# Altium schematic sheet MP2359_ADJ_StepDown100mA.SchDoc: MP2359 ADJ Step Down 100mA
size 152 x 101 mm; Date: 26.07.2015; ApprovedBy: Pavel Nadein; CheckedBy: Pavel Nadein; Author: Pavel Nadein; DrawnBy: Pavel Nadein; Engineer: Pavel Nadein; Revision: P1A; DocumentName: MP2359 ADJ Step Down 100mA
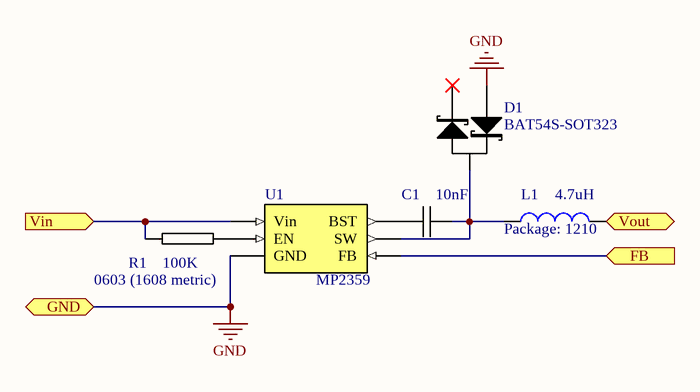
[diagram p0: MP2359_ADJ_StepDown100mA.SchDoc]

## Parts
C1  10nF  [0603C-GENERIC]
D1  BAT54S-SOT323  [SOT323-123]
L1  Inductance: 4.7uH  Package: 1210  [C_1210]  (hidden comment: IND)
R1  100K  Case: 0603 (1608 metric)  [0603R-100K]
U1  MP2359  [TSOP23-6]

## Ports
FB (in), GND, Vin (in), Vout (out)

## Nets
GND: D1.1 U1.2(GND) ; port GND
FB: U1.3(FB) ; port FB
Vin: R1.1 U1.5(Vin) ; port Vin
Vout: L1.2 ; port Vout
NetC1_1: C1.1 U1.1(BST)
NetC1_2: C1.2 D1.3 L1.1 U1.6(SW)
NetR1_2: R1.2 U1.4(EN)

Not connected (* = marked no-connect by the designer): D1 2*

## Library data of the parts
C1 = 0603C-10NF-50V-X7R-MUR: CAPACITOR 0603 CERAMIC; Manufacturer Part Number: GRM188R71H103KA01D; Manufacturer: Murata Electronics North America; Reel: C22; Supplier 1: Digi-Key; Supplier Part Number 1: 490-1512-2-ND
D1 = BAT54S-SOT323: DUAL SCHOTTKY DIODE SERIES; Manufacturer: NXP Semiconductors; Manufacturer Part Number: BAT54SW,115; Voltage - Forward (Vf) (Max) @ If: 800mV @ 100mA; Current - Reverse Leakage @ Vr: 2µA @ 25V; Speed: Small Signal =< 200mA (Io), Any Speed; Diode Configuration: 1 Pair Series Connection; Current - Average Rectified (Io) (per Diode): 200mA (DC); Voltage - DC Reverse (Vr) (Max): 30V; Reverse Recovery Time (trr): 5ns; Supplier 1: Digi-Key; Supplier Part Number 1: 568-1615-2-ND; Mounting Type: Surface Mount; Packaging: Tape & Reel (TR); Package / Case: SC-70-3, SOT-323-3; Diode Type: Schottky; Supplier Part Number: 568-1615-2-ND; Category: Discrete Semiconductor Products; Supplier: Digi-Key; RoHS: RoHS Compliant
L1 = Inductor
R1 = 0603R-100K: GENERIC RESISTOR 0603; Manufacturer Part Number: RMCF 1/16 100K 1% R; Manufacturer: Stackpole Electronics Inc; Tolerance: ±1%; Power (Watts): 0.1W, 1/10W; Temperature Coefficient: ±100ppm/°C; REEL: R47; Resistance In Ohms: 100K; RoHS: RoHS Compliant; Composition: Thick Film; Lead Style: Surface Mount (SMD - SMT); Supplier: Digi-Key; Supplier Part Number: RMCF1/16100KFRCT-ND; Category: Resistors; Packaging: Cut Tape (CT); Supplier 1: Digi-Key; Supplier Part Number 1: RMCF0603FT100KTR-ND
U1 = MP2359: monolithic step-down switch  mode converter with a built-in power MOSFET; Supply Voltage VIN: 4.5V - 24V; Output Voltage VOUT: 0.81V to 15V; Peak Output Current: 1.2A; Frequency: 1.4MHz